# EAGLE design Placa Motor (EAGLE 7.7.0)
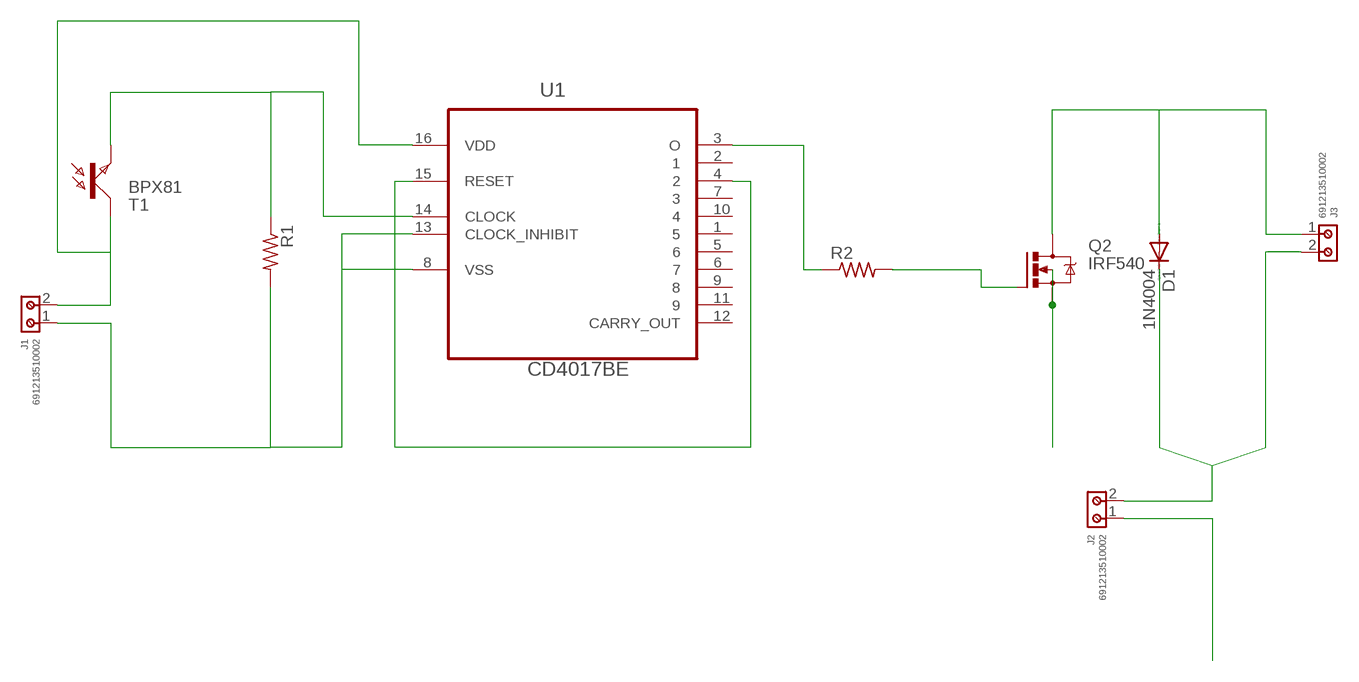
[diagram p0: schematic, sheet 1]

## Parts
D1  1N4004  [DO41-10]
J1  691213510002  [691213510002]
J2  691213510002  [691213510002]
J3  691213510002  [691213510002]
Q2  IRF540  [TO220BV]
R1  R-US_0309/12  [0309/12]
R2  R-US_0309/12  [0309/12]
T1  BPX81  [BPX81]
U1  CD4017BE  [DIP254P762X508-16]

## Nets
GROUND: J1.1 J2.1 Q2.S R1.2 U1.8(VSS) U1.13(CLOCK_INHIBIT)
N$1: J1.2 T1.C U1.16(VDD)
N$2: R1.1 T1.E U1.14(CLOCK)
N$3: U1.4 U1.15(RESET)
N$4: D1.A J3.1 Q2.D
N$5: D1.C J2.2 J3.2
N$7: R2.1 U1.3(O)
N$8: Q2.G R2.2
Unconnected: U1.1 U1.2 U1.5 U1.6 U1.7 U1.9 U1.10 U1.11 U1.12(CARRY_OUT)

## Library data of the parts
D1 = diode:1N4004: DIODE general purpose rectifier, 1 A
J1-J3 = 691213510002:691213510002: WR-TBL Serie 2135 - 5.08 mm Horizontal Entry Modular w. Rising Cage Clamp KIND PROPERTIES Pitch 5.08 mm MATERIAL PROPERTIES Insulator Material PA66 Insulator Flammability Rating UL94 V-0 Contact Material Copper Alloy Contact Plating Tin over Nickel Contact Type Stamped Terminal Screw Material Steel Terminal Screw Plating Zinc Wire Guard Material Copper Alloy GENERAL INFORMATION Operating Temperature -30 up to +120 °C Compliance ROHS & Reach ELECTRICAL PROPERTIES IR UL 14 A IR VDE 14 A Working Voltage [UL] 300 V (AC) Working Voltage [VDE] 250 V (AC) Withstanding Voltage [UL] 1600 V (AC) Withstanding Voltage [VDE] 2000 V (AC) Contact Resistance 20 mΩ MECHANICAL PROPERTIES Wire Strip Length 6 Screw M3 CERTIFICATION UL Approval E150931 VDE Approval 40021366 PACKAGING PROPERTIES Packaging Box <https://www.we-online.com/catalog/media/o32805v209%20Family_WR-TBL2_Series2135.jpg> Details see: https://www.we-online.com/catalog/en/TBL_5_08_2135_HORIZONTAL_ENTRY_MODULAR_69121351000x/ Updated by Ella Wu 2019-11-26 2019(C) Wurth Elektronik Check availability <https://pricing.snapeda.com/parts/691213510002/Wurth%20Electronics/view-part?ref=eda>; AVAILABILITY: In Stock; CHECK_PRICES: https://www.snapeda.com/parts/691213510002/Wurth+Electronics/view-part/?ref=eda; DESCRIPTION: 2 Position Wire to Board Terminal Block Horizontal with Board 0.200 (5.08mm) Through Hole; MF: Wurth Electronics; MP: 691213510002; PACKAGE: None; PRICE: None; SNAPEDA_LINK: https://www.snapeda.com/parts/691213510002/Wurth+Electronics/view-part/?ref=snap
Q2 = transistor-power:IRF540: HEXFET Power MOSFET
R1 R2 = rcl:R-US_: RESISTOR, American symbol
T1 = opto-trans-siemens:BPX81: PHOTO TRANSISTOR; OC_FARNELL: unknown; OC_NEWARK: unknown
U1 = CD4017BE:CD4017BE: CMOS COUNTER/DIVIDERS Check availability <https://pricing.snapeda.com/parts/CD4017BE/Harris%20Corporation/view-part?ref=eda>; AVAILABILITY: In Stock; CHECK_PRICES: https://www.snapeda.com/parts/CD4017BE/WAGO/view-part/?ref=eda; DESCRIPTION: Counter/Divider Single 5-Bit Decade UP 16-Pin PDIP Tube; MF: Harris Corporation; MP: CD4017BE; PACKAGE: None; PRICE: None; SNAPEDA_LINK: https://www.snapeda.com/parts/CD4017BE/WAGO/view-part/?ref=snap

## Board
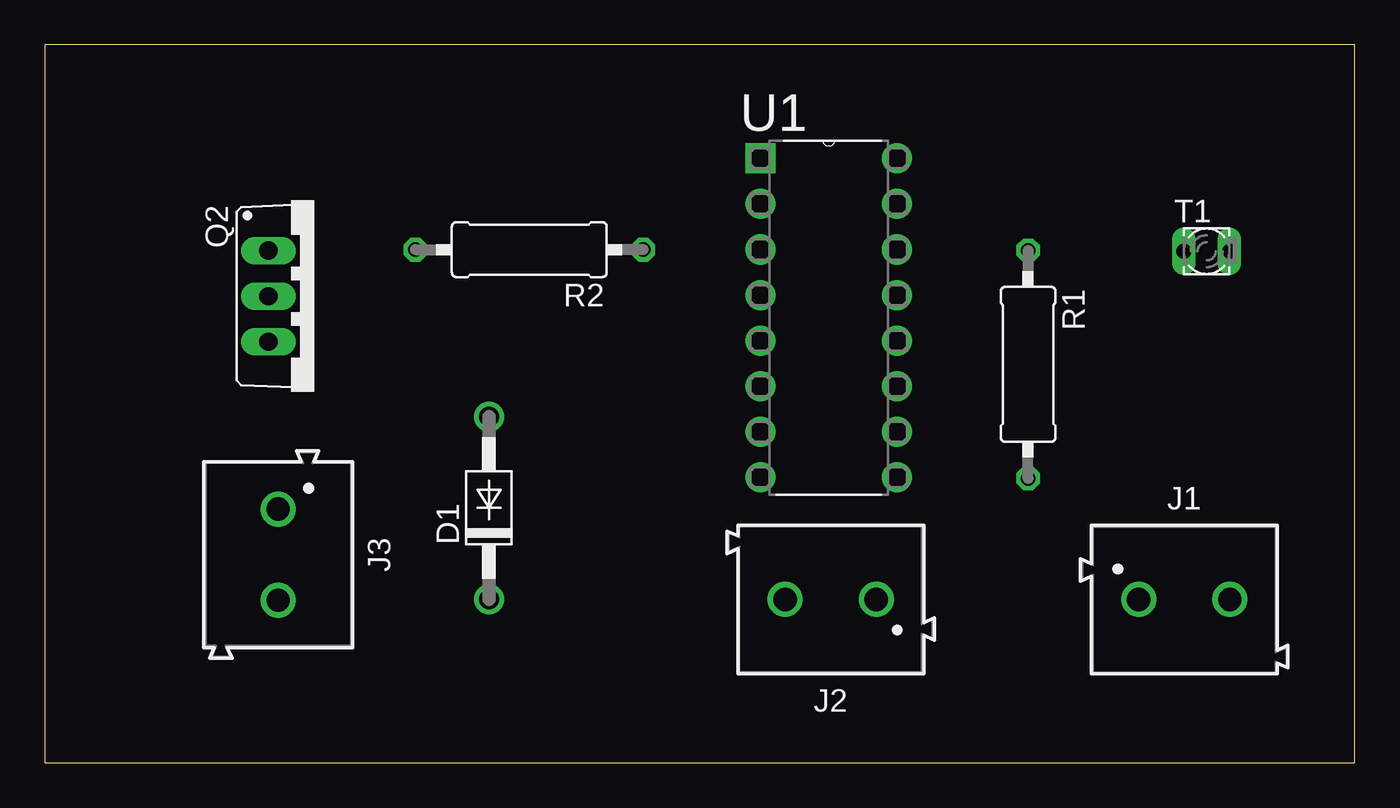
[diagram p1: board, top side]
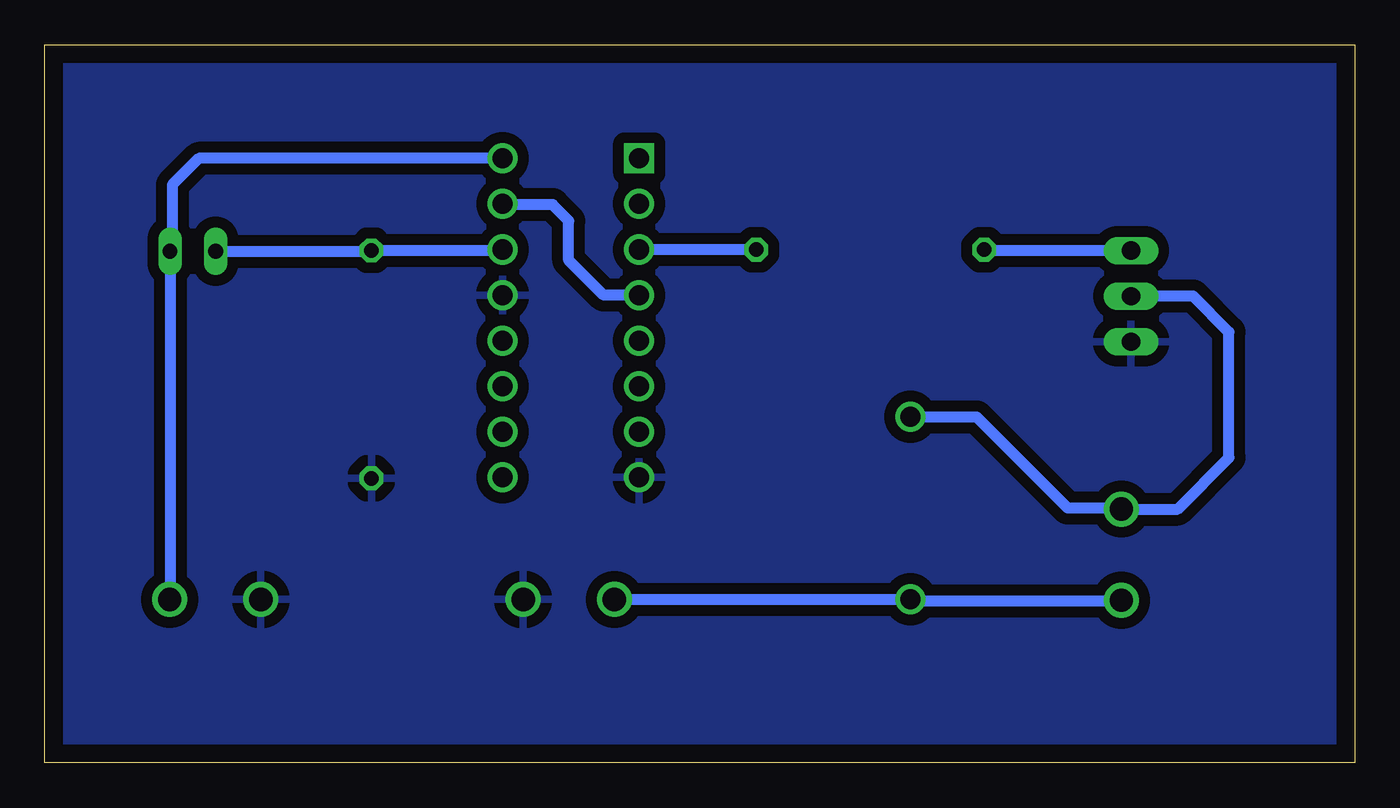
[diagram p2: board, bottom side, seen from below]

Size 73 x 40 mm. Coordinates in mm from the lower left corner, seen from the top.
Outline: 0,0 73,0 73,40 0,40 0,0
Copper layers (1*16): Top 0.035mm / dielectric 1.5mm / Bottom 0.035mm
Design rules "default *": minimum track width 11mil, minimum drill 24mil, track to track 11mil, track to pad 11mil, pad to pad 11mil, via to via 11mil, smd to smd 8mil, copper to edge 40mil, drill to drill 8mil, minimum pad ring 10mil, minimum via ring 8mil, stop-mask expansion 4mil, vias tented up to drill 0mil, thermal gap 25mil

### Footprints (pad centres in the part's own frame; a part is rotated, then mirrored left to right if it is on the bottom)
DO41-10 = drill 1.118: A 5.08,0; C -5.08,0
691213510002 = drill 1.3: 1 -2.54,0; 2 2.54,0
TO220BV = drill 1.016 long: D 0,-2.54; G -2.54,-2.54; S 2.54,-2.54
0309/12 = drill 0.813 octagon: 1 -6.35,0; 2 6.35,0
BPX81 = drill 0.813 long: C 1.27,0; E -1.27,0
DIP254P762X508-16 = drill 1.118 square: 1 -7.62,17.78 | drill 1.118: 2 -7.62,15.24; 3 -7.62,12.7; 4 -7.62,10.16; 5 -7.62,7.62; 6 -7.62,5.08; 7 -7.62,2.54; 8 -7.62,0; 9 0,0; 10 0,2.54; 11 0,5.08; 12 0,7.62; 13 0,10.16; 14 0,12.7; 15 0,15.24; 16 0,17.78

### Placement (x,y rotation side)
D1  24.75,14.2 90 top
J1  63.5,9.1 0 top
J2  43.8,9.1 180 top
J3  13,11.6 270 top
Q2  15,26 270 top
R1  54.8,22.2 270 top
R2  27,28.59 180 top
T1  64.75,28.5 0 top
U1  47.5,15.9 0 top

### Tracks (layer width: path | path; a pad name or v marks a point on that pad's centre or on a via)
GROUND
  pour Bottom (isolate 0.61): 0,0 73,0 73,40 0,40
N$1
  Bottom 0.61: U1.16 64.42,33.68 65.9,32.2 65.9,28.62 T1.C 66.02,9.12 J1.2
N$2
  Bottom 0.61: T1.E 54.85,28.5 R1.1 47.55,28.55 U1.14
N$3
  Bottom 0.61: U1.4 41.86,26.06 43.8,28 43.8,30.2 44.7,31.1 47.46,31.1 U1.15
N$4
  Bottom 0.61: D1.A 21.08,19.28 16,14.2 13.06,14.2 J3.1 9.86,14.14 7,17 7,24 9,26 Q2.D
N$5
  Bottom 0.406: 24.66,9.03 D1.C
  Bottom 0.61: J2.2 24.77,9.1 D1.C | 24.66,9.03 13.03,9.03 J3.2
N$7
  Bottom 0.61: R2.1 U1.3
N$8
  Bottom 0.61: Q2.G 20.6,28.54 R2.2